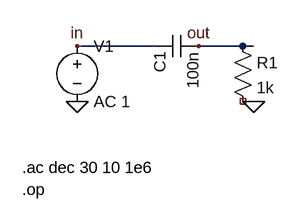
[diagram p0: schematic rc_highpass_ac.asc]
rc_highpass_ac.asc, the LTspice schematic file:
Version 4
SHEET 1 1200 900
WIRE 128 176 240 176
WIRE 304 176 384 176
FLAG 128 176 in
FLAG 304 176 out
FLAG 128 256 0
FLAG 384 256 0
SYMBOL voltage 128 160 R0
SYMATTR InstName V1
SYMATTR Value AC 1
SYMBOL cap 240 160 M90
SYMATTR InstName C1
SYMATTR Value 100n
SYMBOL res 352 160 R0
SYMATTR InstName R1
SYMATTR Value 1k
TEXT 48 352 Left 2 !.ac dec 30 10 1e6
TEXT 48 384 Left 2 !.op

The netlist it stands for:
* rc_highpass_ac.asc
V1 in 0 AC 1
C1 in out 100n
R1 out NC_01 1k
.ac dec 30 10 1e6
.op
.backanno
.end